# EAGLE design cert3d_rev2 (EAGLE 9.4.1)
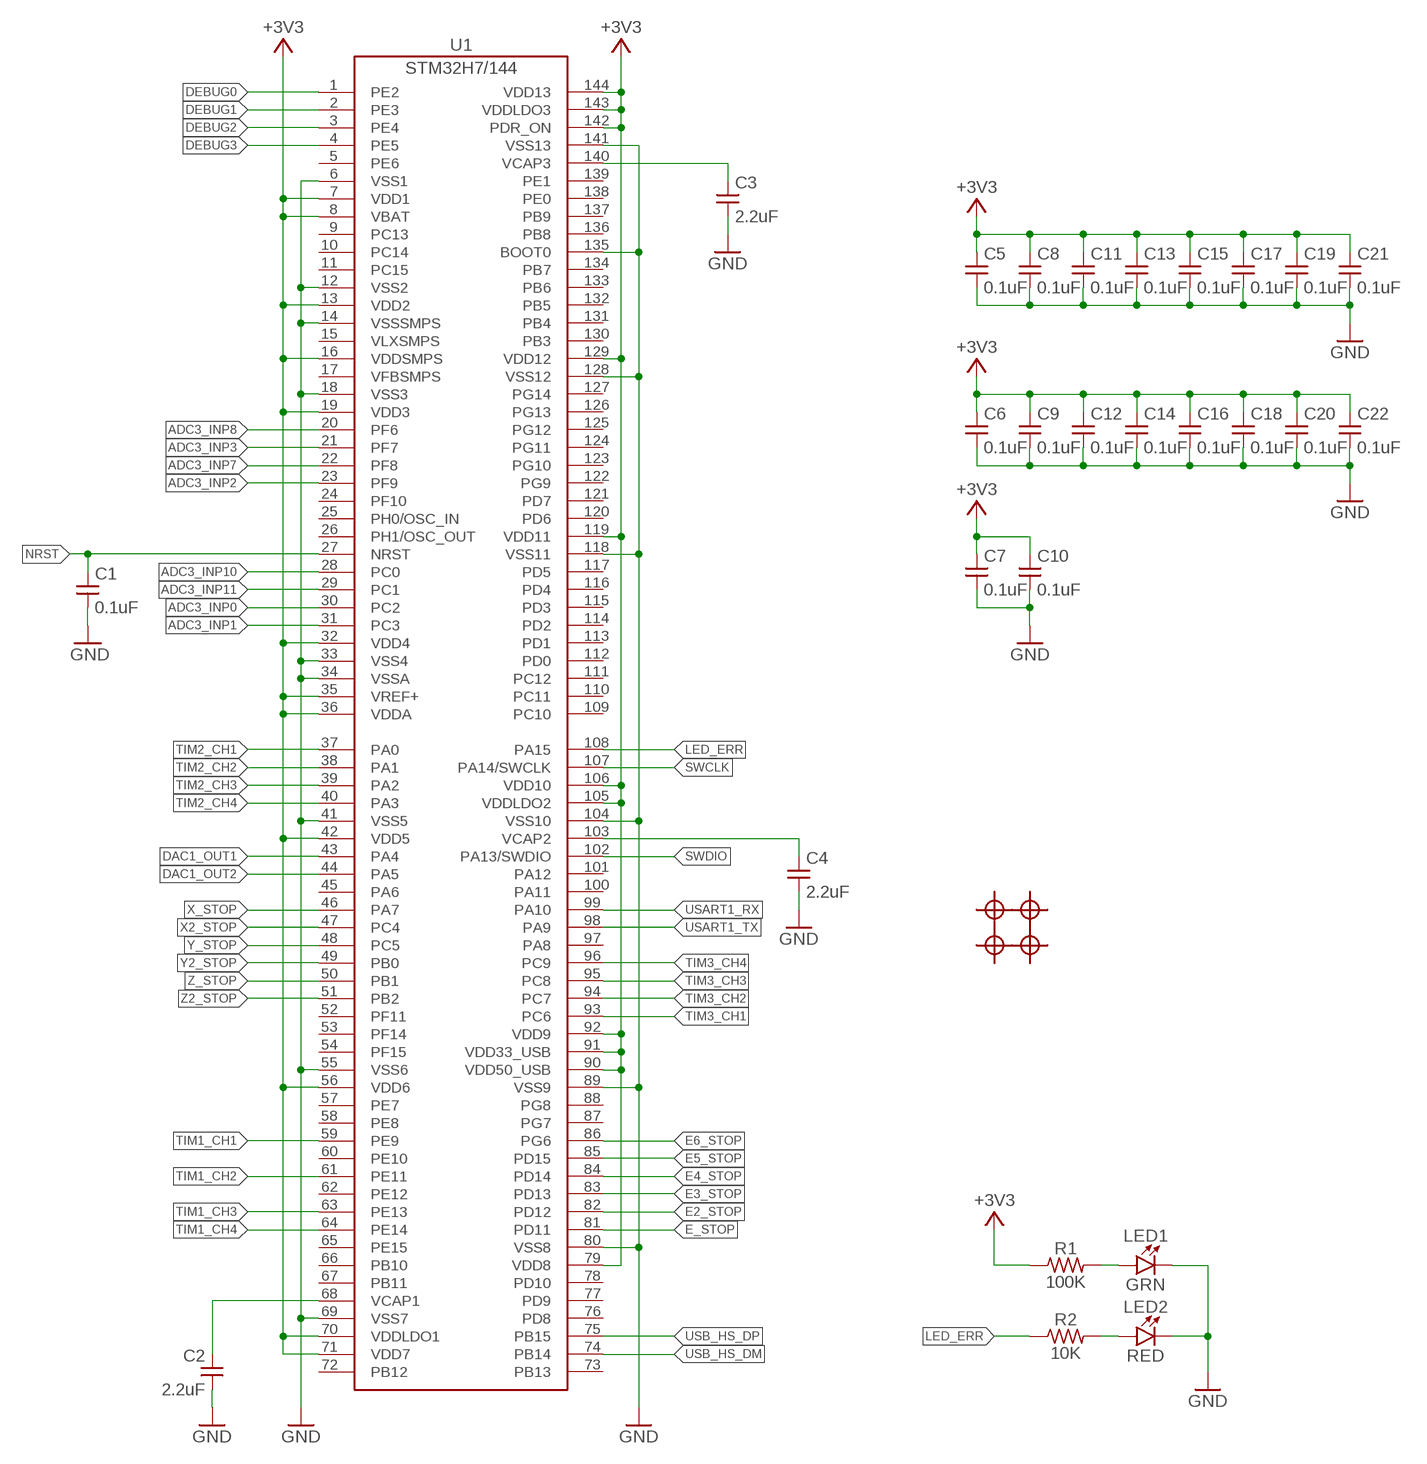
[diagram p0: schematic, sheet 1, part 1 of 2]
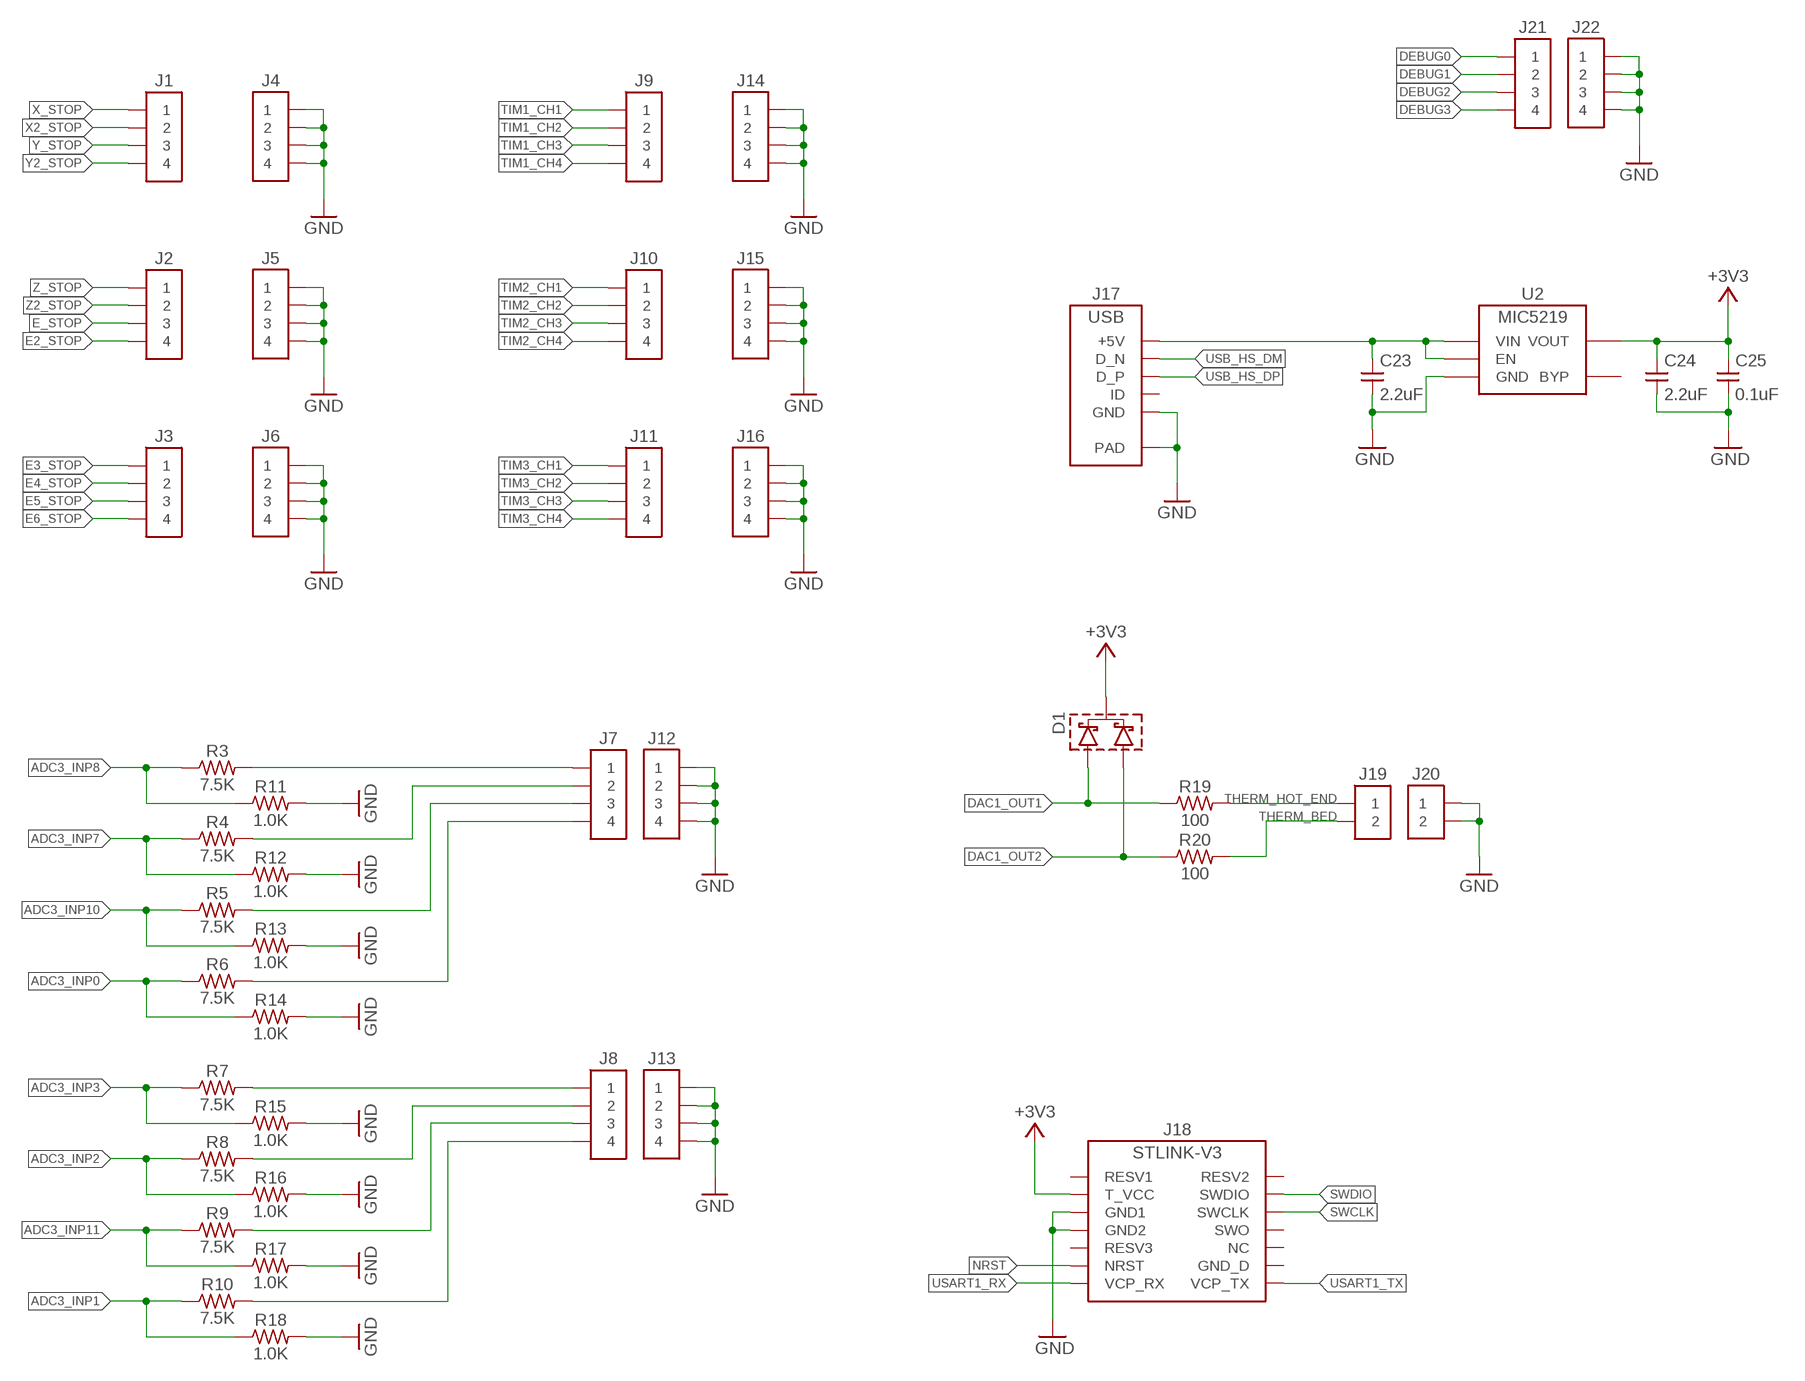
[diagram p1: schematic, sheet 1, part 2 of 2]

## Parts
C1  0.1uF  C_USC0805-5MIL  [C0805-5MIL]
C2  2.2uF  C_USC0805-5MIL  [C0805-5MIL]
C3  2.2uF  C_USC0805-5MIL  [C0805-5MIL]
C4  2.2uF  C_USC0805-5MIL  [C0805-5MIL]
C5  0.1uF  C_USC0805-5MIL  [C0805-5MIL]
C6  0.1uF  C_USC0805-5MIL  [C0805-5MIL]
C7  0.1uF  C_USC0805-5MIL  [C0805-5MIL]
C8  0.1uF  C_USC0805-5MIL  [C0805-5MIL]
C9  0.1uF  C_USC0805-5MIL  [C0805-5MIL]
C10  0.1uF  C_USC0805-5MIL  [C0805-5MIL]
C11  0.1uF  C_USC0805-5MIL  [C0805-5MIL]
C12  0.1uF  C_USC0805-5MIL  [C0805-5MIL]
C13  0.1uF  C_USC0805-5MIL  [C0805-5MIL]
C14  0.1uF  C_USC0805-5MIL  [C0805-5MIL]
C15  0.1uF  C_USC0805-5MIL  [C0805-5MIL]
C16  0.1uF  C_USC0805-5MIL  [C0805-5MIL]
C17  0.1uF  C_USC0805-5MIL  [C0805-5MIL]
C18  0.1uF  C_USC0805-5MIL  [C0805-5MIL]
C19  0.1uF  C_USC0805-5MIL  [C0805-5MIL]
C20  0.1uF  C_USC0805-5MIL  [C0805-5MIL]
C21  0.1uF  C_USC0805-5MIL  [C0805-5MIL]
C22  0.1uF  C_USC0805-5MIL  [C0805-5MIL]
C23  2.2uF  C_USC0805-5MIL  [C0805-5MIL]
C24  2.2uF  C_USC0805-5MIL  [C0805-5MIL]
C25  0.1uF  C_USC0805-5MIL  [C0805-5MIL]
D1  SCHOTTKY_DUAL_CCBAT54C  [SOT23-3]
FD1  FIDUCIAL  [FID1MM]
FD2  FIDUCIAL  [FID1MM]
FD3  FIDUCIAL  [FID1MM]
FD4  FIDUCIAL  [FID1MM]
J1  CONN4TSW-S  [SAM-TSW-104-XX-X-S]
J2  CONN4TSW-S  [SAM-TSW-104-XX-X-S]
J3  CONN4TSW-S  [SAM-TSW-104-XX-X-S]
J4  CONN4TSW-S  [SAM-TSW-104-XX-X-S]
J5  CONN4TSW-S  [SAM-TSW-104-XX-X-S]
J6  CONN4TSW-S  [SAM-TSW-104-XX-X-S]
J7  CONN4TSW-S  [SAM-TSW-104-XX-X-S]
J8  CONN4TSW-S  [SAM-TSW-104-XX-X-S]
J9  CONN4TSW-S  [SAM-TSW-104-XX-X-S]
J10  CONN4TSW-S  [SAM-TSW-104-XX-X-S]
J11  CONN4TSW-S  [SAM-TSW-104-XX-X-S]
J12  CONN4TSW-S  [SAM-TSW-104-XX-X-S]
J13  CONN4TSW-S  [SAM-TSW-104-XX-X-S]
J14  CONN4TSW-S  [SAM-TSW-104-XX-X-S]
J15  CONN4TSW-S  [SAM-TSW-104-XX-X-S]
J16  CONN4TSW-S  [SAM-TSW-104-XX-X-S]
J17  USB-5PINTOPVIA  [HIR-ZX62R-B-5P-VIAS]
J18  STLINK-V3/SWDCNC-3220  [CNC-3220-14-0100-00]
J19  CONN2TSW-S  [SAM-TSW-102-XX-X-S]
J20  CONN2TSW-S  [SAM-TSW-102-XX-X-S]
J21  CONN4TSW-S  [SAM-TSW-104-XX-X-S]
J22  CONN4TSW-S  [SAM-TSW-104-XX-X-S]
LED1  GRN  LEDCHIPLED0805-SMALL  [CHIPLED0805-SMALL]
LED2  RED  LEDCHIPLED0805-SMALL  [CHIPLED0805-SMALL]
R1  100K  R_USRES0805-5MIL  [RES0805R-5MIL]
R2  10K  R_USRES0805-5MIL  [RES0805R-5MIL]
R3  7.5K  R_USRES0805-5MIL  [RES0805R-5MIL]
R4  7.5K  R_USRES0805-5MIL  [RES0805R-5MIL]
R5  7.5K  R_USRES0805-5MIL  [RES0805R-5MIL]
R6  7.5K  R_USRES0805-5MIL  [RES0805R-5MIL]
R7  7.5K  R_USRES0805-5MIL  [RES0805R-5MIL]
R8  7.5K  R_USRES0805-5MIL  [RES0805R-5MIL]
R9  7.5K  R_USRES0805-5MIL  [RES0805R-5MIL]
R10  7.5K  R_USRES0805-5MIL  [RES0805R-5MIL]
R11  1.0K  R_USRES0805-5MIL  [RES0805R-5MIL]
R12  1.0K  R_USRES0805-5MIL  [RES0805R-5MIL]
R13  1.0K  R_USRES0805-5MIL  [RES0805R-5MIL]
R14  1.0K  R_USRES0805-5MIL  [RES0805R-5MIL]
R15  1.0K  R_USRES0805-5MIL  [RES0805R-5MIL]
R16  1.0K  R_USRES0805-5MIL  [RES0805R-5MIL]
R17  1.0K  R_USRES0805-5MIL  [RES0805R-5MIL]
R18  1.0K  R_USRES0805-5MIL  [RES0805R-5MIL]
R19  100  R_USRES0805-5MIL  [RES0805R-5MIL]
R20  100  R_USRES0805-5MIL  [RES0805R-5MIL]
U1  STM32H745-144  [LQFP144-20X20MM]
U2  MIC5219  [SOT23-5]

## Nets
+3V3: C5.1 C6.1 C7.1 C8.1 C9.1 C10.1 C11.1 C12.1 C13.1 C14.1 C15.1 C16.1 C17.1 C18.1 C19.1 C20.1 C21.1 C22.1 C24.1 C25.1 D1.3(C) J18.3(T_VCC) R1.1 U1.7(VDD1) U1.8(VBAT) U1.13(VDD2) U1.16(VDDSMPS) U1.19(VDD3) U1.32(VDD4) U1.35(VREF+) U1.36(VDDA) U1.42(VDD5) U1.56(VDD6) U1.70(VDDLDO1) U1.71(VDD7) U1.79(VDD8) U1.90(VDD50_USB) U1.91(VDD33_USB) U1.92(VDD9) U1.105(VDDLDO2) U1.106(VDD10) U1.119(VDD11) U1.129(VDD12) U1.142(PDR_ON) U1.143(VDDLDO3) U1.144(VDD13) U2.5(VOUT)
ADC3_INP0: R6.1 R14.1 U1.30(PC2)
ADC3_INP1: R10.1 R18.1 U1.31(PC3)
ADC3_INP2: R8.1 R16.1 U1.23(PF9)
ADC3_INP3: R7.1 R15.1 U1.21(PF7)
ADC3_INP7: R4.1 R12.1 U1.22(PF8)
ADC3_INP8: R3.1 R11.1 U1.20(PF6)
ADC3_INP10: R5.1 R13.1 U1.28(PC0)
ADC3_INP11: R9.1 R17.1 U1.29(PC1)
DAC1_OUT1: D1.1(A1) R19.1 U1.43(PA4)
DAC1_OUT2: D1.2(A2) R20.1 U1.44(PA5)
DEBUG0: J21.1 U1.1(PE2)
DEBUG1: J21.2 U1.2(PE3)
DEBUG2: J21.3 U1.3(PE4)
DEBUG3: J21.4 U1.4(PE5)
E2_STOP: J2.4 U1.82(PD12)
E3_STOP: J3.1 U1.83(PD13)
E4_STOP: J3.2 U1.84(PD14)
E5_STOP: J3.3 U1.85(PD15)
E6_STOP: J3.4 U1.86(PG6)
E_STOP: J2.3 U1.81(PD11)
GND: C1.2 C2.2 C3.2 C4.2 C5.2 C6.2 C7.2 C8.2 C9.2 C10.2 C11.2 C12.2 C13.2 C14.2 C15.2 C16.2 C17.2 C18.2 C19.2 C20.2 C21.2 C22.2 C23.2 C24.2 C25.2 J4.1 J4.2 J4.3 J4.4 J5.1 J5.2 J5.3 J5.4 J6.1 J6.2 J6.3 J6.4 J12.1 J12.2 J12.3 J12.4 J13.1 J13.2 J13.3 J13.4 J14.1 J14.2 J14.3 J14.4 J15.1 J15.2 J15.3 J15.4 J16.1 J16.2 J16.3 J16.4 J17.5(GND) J17.PAD@1(PAD) J17.PAD@2(PAD) J17.PAD@3(PAD) J17.PAD@4(PAD) J17.PAD@5(PAD) J17.PAD@6(PAD) J17.PAD@7(PAD) J17.PAD@8(PAD) J17.PAD@9(PAD) J17.PAD@10(PAD) J17.PAD@11(PAD) J17.PAD@12(PAD) J18.5(GND1) J18.7(GND2) J20.1 J20.2 J22.1 J22.2 J22.3 J22.4 LED1.C LED2.C R11.2 R12.2 R13.2 R14.2 R15.2 R16.2 R17.2 R18.2 U1.6(VSS1) U1.12(VSS2) U1.14(VSSSMPS) U1.18(VSS3) U1.33(VSS4) U1.34(VSSA) U1.41(VSS5) U1.55(VSS6) U1.69(VSS7) U1.80(VSS8) U1.89(VSS9) U1.104(VSS10) U1.118(VSS11) U1.128(VSS12) U1.135(BOOT0) U1.141(VSS13) U2.2(GND)
LED_ERR: R2.1 U1.108(PA15)
N$1: C2.1 U1.68(VCAP1)
N$2: C4.1 U1.103(VCAP2)
N$3: J7.3 R5.2
N$5: J7.1 R3.2
N$6: J8.2 R8.2
N$7: J7.2 R4.2
N$9: C3.1 U1.140(VCAP3)
N$10: C23.1 J17.1(+5V) U2.1(VIN) U2.3(EN)
N$13: J8.3 R9.2
N$14: J7.4 R6.2
N$15: J8.4 R10.2
N$16: J8.1 R7.2
N$23: LED2.A R2.2
N$24: LED1.A R1.2
NRST: C1.1 J18.11(NRST) U1.27(NRST)
SWCLK: J18.6(SWCLK) U1.107(PA14/SWCLK)
SWDIO: J18.4(SWDIO) U1.102(PA13/SWDIO)
THERM_BED: J19.2 R20.2
THERM_HOT_END: J19.1 R19.2
TIM1_CH1: J9.1 U1.59(PE9)
TIM1_CH2: J9.2 U1.61(PE11)
TIM1_CH3: J9.3 U1.63(PE13)
TIM1_CH4: J9.4 U1.64(PE14)
TIM2_CH1: J10.1 U1.37(PA0)
TIM2_CH2: J10.2 U1.38(PA1)
TIM2_CH3: J10.3 U1.39(PA2)
TIM2_CH4: J10.4 U1.40(PA3)
TIM3_CH1: J11.1 U1.93(PC6)
TIM3_CH2: J11.2 U1.94(PC7)
TIM3_CH3: J11.3 U1.95(PC8)
TIM3_CH4: J11.4 U1.96(PC9)
USART1_RX: J18.13(VCP_RX) U1.99(PA10)
USART1_TX: J18.14(VCP_TX) U1.98(PA9)
USB_HS_DM: J17.2(D_N) U1.74(PB14)
USB_HS_DP: J17.3(D_P) U1.75(PB15)
X2_STOP: J1.2 U1.47(PC4)
X_STOP: J1.1 U1.46(PA7)
Y2_STOP: J1.4 U1.49(PB0)
Y_STOP: J1.3 U1.48(PC5)
Z2_STOP: J2.2 U1.51(PB2)
Z_STOP: J2.1 U1.50(PB1)
Unconnected: J17.4(ID) J18.1(RESV1) J18.2(RESV2) J18.8(SWO) J18.9(RESV3) J18.10(NC) J18.12(GND_D) U1.5(PE6) U1.9(PC13) U1.10(PC14) U1.11(PC15) U1.15(VLXSMPS) U1.17(VFBSMPS) U1.24(PF10) U1.25(PH0/OSC_IN) U1.26(PH1/OSC_OUT) U1.45(PA6) U1.52(PF11) U1.53(PF14) U1.54(PF15) U1.57(PE7) U1.58(PE8) U1.60(PE10) U1.62(PE12) U1.65(PE15) U1.66(PB10) U1.67(PB11) U1.72(PB12) U1.73(PB13) U1.76(PD8) U1.77(PD9) U1.78(PD10) U1.87(PG7) U1.88(PG8) U1.97(PA8) U1.100(PA11) U1.101(PA12) U1.109(PC10) U1.110(PC11) U1.111(PC12) U1.112(PD0) U1.113(PD1) U1.114(PD2) U1.115(PD3) U1.116(PD4) U1.117(PD5) U1.120(PD6) U1.121(PD7) U1.122(PG9) U1.123(PG10) U1.124(PG11) U1.125(PG12) U1.126(PG13) U1.127(PG14) U1.130(PB3) U1.131(PB4) U1.132(PB5) U1.133(PB6) U1.134(PB7) U1.136(PB8) U1.137(PB9) U1.138(PE0) U1.139(PE1) U2.4(BYP)

## Library data of the parts
C1 C5-C22 C25 = kcl_passives:C_US; PN: C0805C104K5RACTU
C2-C4 = kcl_passives:C_US; PN: C0805C225K3RAC7800
C23 C24 = kcl_passives:C_US; PN: C0805C225K8RACTU
D1 = kcl_passives:SCHOTTKY_DUAL_CC; PN: BAT54CLT1G
FD1-FD4 = kcl_extra:FIDUCIAL; PN: DNI
J1-J16 J21 J22 = kcl_connectors_auto:CONN4; PN: TSW-104-07-F-S
J17 = kcl_connectors:USB-5PIN; PN: ZX62R-B-5P(30)
J18 = kcl_connectors:STLINK-V3/SWD; PN: 3220-14-0100-00
J19 J20 = kcl_connectors_auto:CONN2; PN: TSW-102-07-F-S
LED1 = kcl_passives:LED; PN: 150080GS75000
LED2 = kcl_passives:LED; PN: 150080RS75000
R1 = kcl_passives:R_US; PN: CRCW0805100KFKEA
R2 = kcl_passives:R_US; PN: CRCW080510K0FKEA
R3-R10 = kcl_passives:R_US; PN: CRCW08057K50FKEA
R11-R18 = kcl_passives:R_US; PN: CRCW08051K00FKEA
R19 R20 = kcl_passives:R_US; PN: CRCW0805100RFKEA
U1 = kcl_ics:STM32H745-144
U2 = kcl_ics:MIC5219; PN: MIC5323-3.3YD5-TR

## Net classes
0 default: width 0.254 mm

## Board
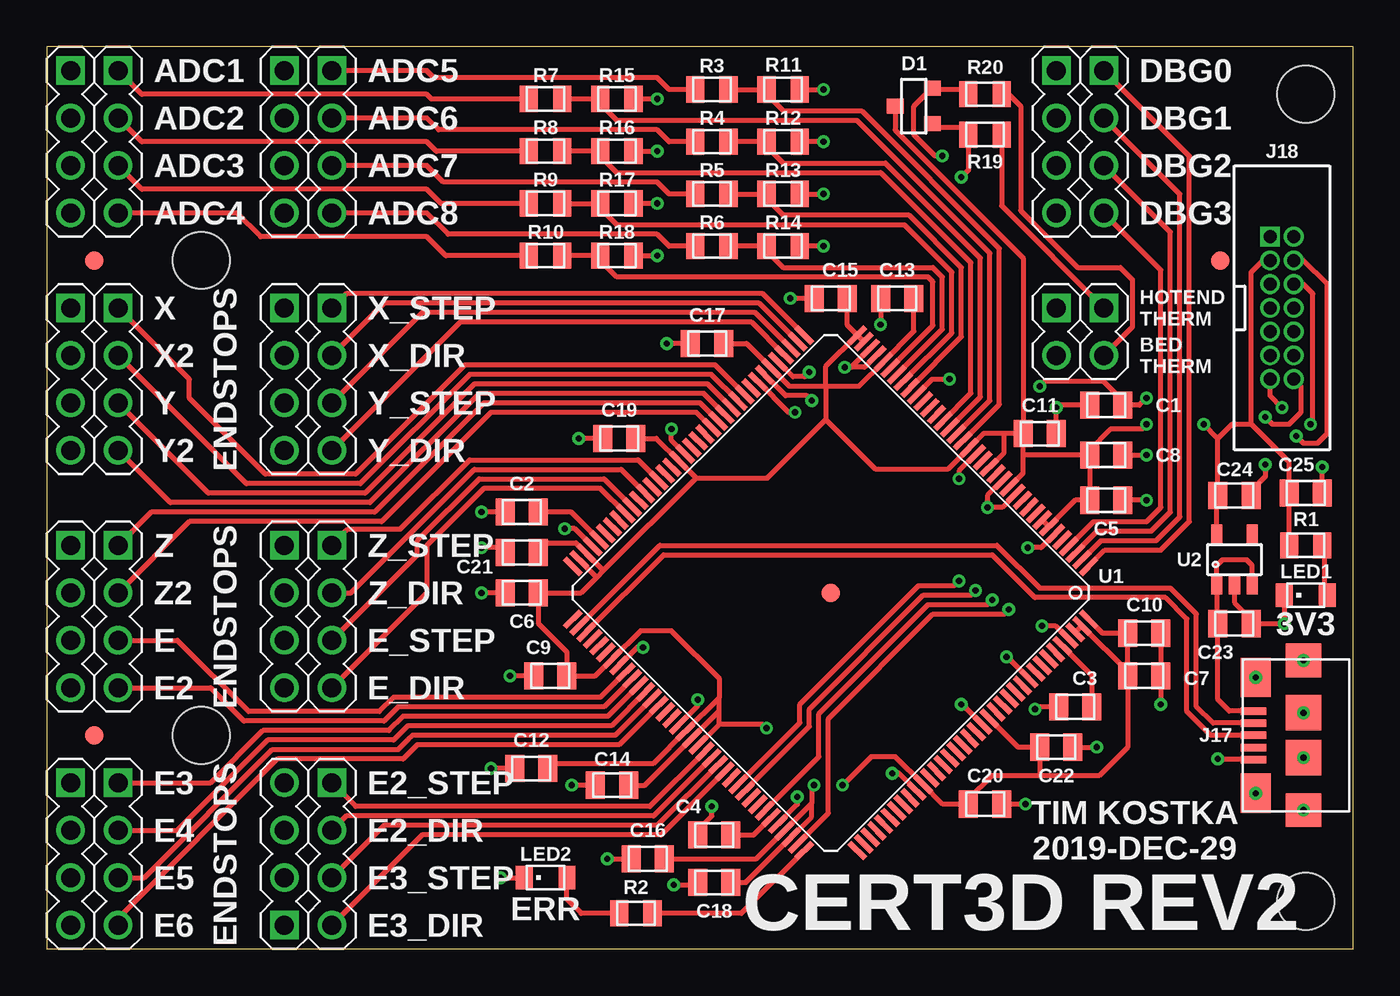
[diagram p2: board, top side]
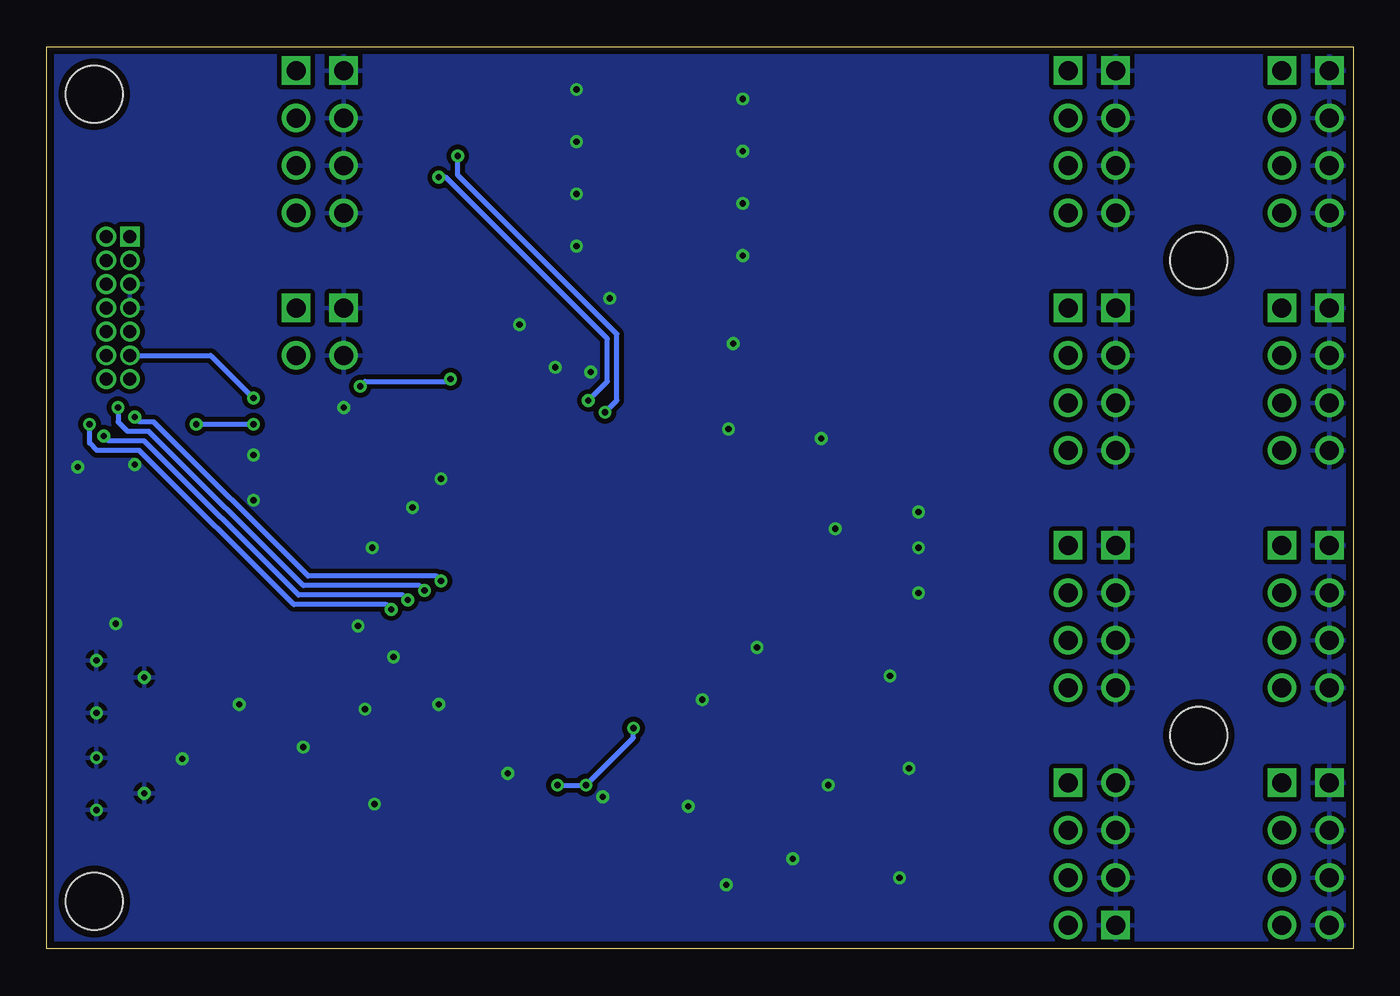
[diagram p3: board, bottom side, seen from below]

Size 69.85 x 48.26 mm. Coordinates in mm from the lower left corner, seen from the top.
Outline: 0,0 69.85,0 69.85,48.26 0,48.26 0,0
Copper layers (1*16): Top 0.0356mm / dielectric 1.5011mm / Bottom 0.0356mm
Design rules "oshpark-2layer *": minimum track width 6mil, minimum drill 13mil, track to track 6mil, track to pad 6mil, pad to pad 6mil, via to via 6mil, smd to smd 6mil, copper to edge 15mil, drill to drill 6mil, minimum pad ring 7mil, minimum via ring 7mil, stop-mask expansion 4mil, vias tented up to drill 13mil, thermal gap 10mil
Holes 3.05 mm at 8.26,36.83 8.26,11.43 67.31,2.54 67.31,45.72

### Footprints (pad centres in the part's own frame; a part is rotated, then mirrored left to right if it is on the bottom)
C0805-5MIL = smd 1.016 x 1.448: 1 -0.889,0; 2 0.889,0
SOT23-3 = smd 0.9 x 0.8: 1 -1,0.95; 2 -1,-0.95; 3 1,0
FID1MM = smd 1 x 1: 1 0,0
SAM-TSW-104-XX-X-S = drill 1.016 square: 1 -3.81,0 | drill 1.016: 2 -1.27,0; 3 1.27,0; 4 3.81,0
HIR-ZX62R-B-5P-VIAS = smd 0.4 x 1.35: 1 -1.3,0; 2 -0.65,0; 3 0,0; 4 0.65,0; 5 1.3,0 | smd 2.1 x 1.6: PAD@1 3.1,0.125; PAD@2 -3.1,0.125 | smd 1.8 x 1.9: PAD@3 4,2.675; PAD@4 -4,2.675 | smd 1.9 x 1.9: PAD@5 1.2,2.675; PAD@6 -1.2,2.675 | drill 0.33: PAD@7 -3.1,0.125; PAD@8 -4,2.675; PAD@9 -1.2,2.675; PAD@10 1.2,2.675; PAD@11 4,2.675; PAD@12 3.1,0.125
CNC-3220-14-0100-00 = drill 0.7 square: 1 -0.635,3.81 | drill 0.7: 2 0.635,3.81; 3 -0.635,2.54; 4 0.635,2.54; 5 -0.635,1.27; 6 0.635,1.27; 7 -0.635,0; 8 0.635,0; 9 -0.635,-1.27; 10 0.635,-1.27; 11 -0.635,-2.54; 12 0.635,-2.54; 13 -0.635,-3.81; 14 0.635,-3.81
SAM-TSW-102-XX-X-S = drill 1.016 square: 1 -1.27,0 | drill 1.016: 2 1.27,0
CHIPLED0805-SMALL = smd 0.9 x 1.25: A 1.143,0; C -1.143,0
RES0805R-5MIL = smd 0.965 x 1.4: 1 -0.889,0; 2 0.889,0
LQFP144-20X20MM = smd 1.2 x 0.3: 1 -10.75,8.75; 2 -10.75,8.25; 3 -10.75,7.75; 4 -10.75,7.25; 5 -10.75,6.75; 6 -10.75,6.25; 7 -10.75,5.75; 8 -10.75,5.25; 9 -10.75,4.75; 10 -10.75,4.25; 11 -10.75,3.75; 12 -10.75,3.25; 13 -10.75,2.75; 14 -10.75,2.25; 15 -10.75,1.75; 16 -10.75,1.25; 17 -10.75,0.75; 18 -10.75,0.25; 19 -10.75,-0.25; 20 -10.75,-0.75; 21 -10.75,-1.25; 22 -10.75,-1.75; 23 -10.75,-2.25; 24 -10.75,-2.75; 25 -10.75,-3.25; 26 -10.75,-3.75; 27 -10.75,-4.25; 28 -10.75,-4.75; 29 -10.75,-5.25; 30 -10.75,-5.75; 31 -10.75,-6.25; 32 -10.75,-6.75; 33 -10.75,-7.25; 34 -10.75,-7.75; 35 -10.75,-8.25; 36 -10.75,-8.75; 73 10.75,-8.75; 74 10.75,-8.25; 75 10.75,-7.75; 76 10.75,-7.25; 77 10.75,-6.75; 78 10.75,-6.25; 79 10.75,-5.75; 80 10.75,-5.25; 81 10.75,-4.75; 82 10.75,-4.25; 83 10.75,-3.75; 84 10.75,-3.25; 85 10.75,-2.75; 86 10.75,-2.25; 87 10.75,-1.75; 88 10.75,-1.25; 89 10.75,-0.75; 90 10.75,-0.25; 91 10.75,0.25; 92 10.75,0.75; 93 10.75,1.25; 94 10.75,1.75; 95 10.75,2.25; 96 10.75,2.75; 97 10.75,3.25; 98 10.75,3.75; 99 10.75,4.25; 100 10.75,4.75; 101 10.75,5.25; 102 10.75,5.75; 103 10.75,6.25; 104 10.75,6.75; 105 10.75,7.25; 106 10.75,7.75; 107 10.75,8.25; 108 10.75,8.75 | smd 0.3 x 1.2: 37 -8.75,-10.75; 38 -8.25,-10.75; 39 -7.75,-10.75; 40 -7.25,-10.75; 41 -6.75,-10.75; 42 -6.25,-10.75; 43 -5.75,-10.75; 44 -5.25,-10.75; 45 -4.75,-10.75; 46 -4.25,-10.75; 47 -3.75,-10.75; 48 -3.25,-10.75; 49 -2.75,-10.75; 50 -2.25,-10.75; 51 -1.75,-10.75; 52 -1.25,-10.75; 53 -0.75,-10.75; 54 -0.25,-10.75; 55 0.25,-10.75; 56 0.75,-10.75; 57 1.25,-10.75; 58 1.75,-10.75; 59 2.25,-10.75; 60 2.75,-10.75; 61 3.25,-10.75; 62 3.75,-10.75; 63 4.25,-10.75; 64 4.75,-10.75; 65 5.25,-10.75; 66 5.75,-10.75; 67 6.25,-10.75; 68 6.75,-10.75; 69 7.25,-10.75; 70 7.75,-10.75; 71 8.25,-10.75; 72 8.75,-10.75; 109 8.75,10.75; 110 8.25,10.75; 111 7.75,10.75; 112 7.25,10.75; 113 6.75,10.75; 114 6.25,10.75; 115 5.75,10.75; 116 5.25,10.75; 117 4.75,10.75; 118 4.25,10.75; 119 3.75,10.75; 120 3.25,10.75; 121 2.75,10.75; 122 2.25,10.75; 123 1.75,10.75; 124 1.25,10.75; 125 0.75,10.75; 126 0.25,10.75; 127 -0.25,10.75; 128 -0.75,10.75; 129 -1.25,10.75; 130 -1.75,10.75; 131 -2.25,10.75; 132 -2.75,10.75; 133 -3.25,10.75; 134 -3.75,10.75; 135 -4.25,10.75; 136 -4.75,10.75; 137 -5.25,10.75; 138 -5.75,10.75; 139 -6.25,10.75; 140 -6.75,10.75; 141 -7.25,10.75; 142 -7.75,10.75; 143 -8.25,10.75; 144 -8.75,10.75
SOT23-5 = smd 1.05 x 0.6: 1 -1.35,0.95; 2 -1.35,0; 3 -1.35,-0.95; 4 1.35,-0.95; 5 1.35,0.95

### Placement (x,y rotation side)
C1  56.64,29.08 180 top
C2  25.4,23.37 180 top
C3  54.99,12.95 180 top
C4  35.69,6.1 180 top
C5  56.64,24 0 top
C6  25.4,19.05 180 top
C7  58.67,14.61 0 top
C8  56.64,26.42 0 top
C9  26.92,14.61 180 top
C10  58.67,16.89 0 top
C11  53.09,27.56 0 top
C12  25.91,9.65 180 top
C13  45.47,34.8 180 top
C14  30.23,8.76 180 top
C15  41.91,34.8 180 top
C16  32.13,4.83 180 top
C17  35.31,32.38 180 top
C18  35.69,3.56 180 top
C19  30.61,27.3 180 top
C20  50.16,7.75 0 top
C21  25.4,21.21 180 top
C22  53.98,10.79 0 top
C23  63.5,17.4 0 top
C24  63.5,24.26 0 top
C25  67.31,24.38 0 top
D1  46.35,45.09 180 top
FD1  2.54,36.83 0 top
FD2  41.91,19.05 0 top
FD3  62.74,36.83 0 top
FD4  2.54,11.43 0 top
J1  3.81,30.48 270 top
J2  3.81,17.78 270 top
J3  3.81,5.08 270 top
J4  1.27,30.48 270 top
J5  1.27,17.78 270 top
J6  1.27,5.08 270 top
J7  15.24,43.18 270 top
J8  3.81,43.18 270 top
J9  15.24,17.78 270 top
J10  15.24,30.48 270 top
J11  15.24,5.08 270 top
J12  1.27,43.18 270 top
J13  12.7,43.18 270 top
J14  12.7,17.78 270 top
J15  12.7,30.48 270 top
J16  12.7,5.08 90 top
J17  64.52,11.43 270 top
J18  66.04,34.29 0 top
J19  56.52,33.02 270 top
J20  53.98,33.02 270 top
J21  56.52,43.18 270 top
J22  53.98,43.18 270 top
LED1  67.31,18.92 0 top
LED2  26.67,3.81 0 top
R1  67.31,21.59 0 top
R2  31.5,1.91 180 top
R3  35.56,45.97 180 top
R4  35.56,43.18 180 top
R5  35.56,40.39 180 top
R6  35.56,37.59 180 top
R7  26.67,45.47 180 top
R8  26.67,42.67 180 top
R9  26.67,39.88 180 top
R10  26.67,37.08 180 top
R11  39.37,45.97 0 top
R12  39.37,43.18 0 top
R13  39.37,40.39 0 top
R14  39.37,37.59 0 top
R15  30.48,45.47 0 top
R16  30.48,42.67 0 top
R17  30.48,39.88 0 top
R18  30.48,37.08 0 top
R19  50.16,43.56 0 top
R20  50.16,45.72 0 top
U1  41.91,19.05 225 top
U2  63.5,20.83 90 top

### Tracks (layer width: path | path; a pad name or v marks a point on that pad's centre or on a via)
+3V3  (via drill 0.33)
  Top 0.254: C11.1 51.18,27.56 | 51.18,27.56 50.06,27.56 U1.19 48.16,25.65 44.32,25.65 41.66,28.32 | U1.35 U1.36 | C17.1 37.41,32.38 U1.42 39.7,30.1 41.66,30.1 | C19.1 32.59,27.3 U1.56 34.71,25.19 | C14.1 31.98,8.76 U1.91 35.94,12.73 | C16.1 37.94,4.83 U1.105 40.89,7.78 | C18.1 37.38,3.56 U1.106 40.89,7.07 40.89,7.78 | U1.129 51.93,10.79 C22.1 53.09,9.27 | U1.144 56.44,16.89 C10.1 C7.1 | C7.1 57.78,14.84 U1.143 U1.142 | U1.36 42.8,33.36 C15.1 | C13.1 46.35,33.04 U1.32 43.41,30.1 41.66,30.1 | C21.1 26.8,21.72 28.28,21.72 U1.70 29.76,20.24 | 29.76,20.24 29.41,19.88 | 29.41,19.88 28.57,19.05 C6.1 26.29,17.4 27.81,15.88 C9.1 29.33,14.61 U1.79 31.75,17.02 33.4,17.02 35.94,14.48 35.94,13.44 | C12.1 27.05,9.91 32.41,9.91 U1.90 35.94,13.44 | U1.16 51.18,26.55 51.18,27.56 | R1.1 C25.1 66.42,26.04 64.39,28.07 | U1.71 29.41,19.88 | 29.76,20.24 34.71,25.19 | 35.94,12.73 35.94,13.44 | U1.92 35.94,12.02 | 35.94,12.02 35.94,12.73 | U2.5 62.55,24.2 C24.1 62.61,27.3 | C7.1 57.78,10.79 56.26,9.27 53.09,9.27 | 53.09,9.27 50.55,9.27 49.28,8 C20.1 47.91,7.75 U1.119 45.37,10.29 44.07,10.29 v42.55,8.76 | U1.36 41.66,31.17 41.66,30.1 | 41.66,30.1 41.66,28.32 | 41.66,28.32 38.52,25.19 34.71,25.19 | U1.8 U1.7 54.99,24 C5.1 C8.1 | J18.3 65.02,36.83 64.39,36.2 64.39,28.07 | 62.61,27.3 v61.85,28.07 | 62.61,27.3 63.37,28.07 64.39,28.07 | v58.8,28.07 58.55,27.81 56.9,27.81 55.75,26.67 C8.1 | 40.89,7.78 40.89,8.64 v41.02,8.76 | v38.48,11.81 38.27,12.02 35.94,12.02 | U1.13 52.2,25.45 52.2,26.42 | 52.2,26.42 C11.1 | C8.1 52.2,26.42 | D1.3 45.35,43.8 52.2,36.96 C11.1
  Bottom 0.254: v61.85,28.07 v58.8,28.07 | v42.55,8.76 v41.02,8.76 38.48,11.3 v38.48,11.81
ADC3_INP0
  Top 0.254: U1.30 47.88,33.15 47.88,35.94 47.37,36.45 39.37,36.45 38.48,37.34 R14.1 R6.1
ADC3_INP1
  Top 0.254: U1.31 47.37,33.35 47.37,35.69 47.12,35.94 30.48,35.94 29.59,36.83 R18.1 R10.1
ADC3_INP2
  Top 0.254: U1.23 49.4,29.73 49.4,36.7 44.58,41.53 30.48,41.53 29.59,42.42 R16.1 R8.1
ADC3_INP3
  Top 0.254: U1.21 50.42,29.33 50.42,37.21 43.31,44.32 30.48,44.32 29.59,45.21 R15.1 R7.1
ADC3_INP7
  Top 0.254: U1.22 49.91,29.53 49.91,36.96 44.83,42.04 39.37,42.04 38.48,42.93 R12.1 R4.1
ADC3_INP8
  Top 0.254: U1.20 50.93,29.13 50.93,37.47 43.56,44.83 39.37,44.83 38.48,45.72 R11.1 R3.1
ADC3_INP10
  Top 0.254: U1.28 48.9,32.75 48.9,36.45 46.1,39.24 39.37,39.24 38.48,40.13 R13.1 R5.1
ADC3_INP11
  Top 0.254: U1.29 48.39,32.95 48.39,36.2 45.85,38.73 30.48,38.73 29.59,39.62 R17.1 R9.1
DAC1_OUT1  (via drill 0.33)
  Top 0.254: D1.1 47.55,43.94 48.9,43.94 R19.1 49.28,41.66 v48.9,41.27 | U1.43 39.5,29.59 40.64,29.59 v40.89,29.34
  Bottom 0.254: v40.89,29.34 39.88,30.35 39.88,32.64 48.51,41.27 v48.9,41.27
DAC1_OUT2  (via drill 0.33)
  Top 0.254: R20.1 49.02,45.97 47.42,45.97 D1.2 47.3,46.03 46.35,45.09 46.35,43.56 47.5,42.42 v47.88,42.42 | U1.44 39.68,28.7 v40.01,28.7
  Bottom 0.254: v40.01,28.7 39.37,29.34 39.37,32.89 47.88,41.4 v47.88,42.42
DEBUG0
  Top 0.254: U1.1 56.57,21.34 59.56,21.34 61.09,22.86 61.09,42.42 J21.1
DEBUG1
  Top 0.254: U1.2 56.37,21.84 59.31,21.84 60.58,23.11 60.58,40.39 J21.2
DEBUG2
  Top 0.254: U1.3 56.17,22.35 59.05,22.35 60.07,23.37 60.07,38.35 J21.3
DEBUG3
  Top 0.254: U1.4 55.97,22.86 58.8,22.86 59.56,23.62 59.56,36.32 J21.4
E2_STOP
  Top 0.254: J2.4 8.76,13.97 10.54,12.19 18.03,12.19 18.8,12.95 29.8,12.95 U1.82
E3_STOP
  Top 0.254: J3.1 8.76,8.89 11.56,11.68 18.29,11.68 19.05,12.45 30,12.45 U1.83
E4_STOP
  Top 0.254: J3.2 6.99,6.35 11.81,11.18 18.54,11.18 19.3,11.94 30.2,11.94 U1.84
E5_STOP
  Top 0.254: J3.3 5.21,3.81 12.06,10.67 18.8,10.67 19.3,11.18 19.56,11.43 30.4,11.43 U1.85
E6_STOP
  Top 0.254: J3.4 3.81,1.65 12.32,10.16 19.05,10.16 19.81,10.92 30.6,10.92 U1.86
E_STOP
  Top 0.254: J2.3 6.99,16.51 10.79,12.7 17.78,12.7 18.54,13.46 29.6,13.46 U1.81
GND  (via drill 0.33)
  Top 0.254: v41.53,37.59 R14.2 | R13.2 v41.53,40.39 | v41.53,43.18 R12.2 | R11.2 v41.53,45.97 | v32.64,45.47 R15.2 | R16.2 v32.64,42.67 | v32.64,39.88 R17.2 | R18.2 v32.64,37.08 | C2.2 v23.24,23.37 | C21.2 24.26,21.46 v23.24,21.46 | C6.2 v23.24,19.05 | C19.2 v28.45,27.3 | C17.2 v33.15,32.38 | C9.2 v24.77,14.61 | C12.2 v23.75,9.65 | U1.69 28.23,22.48 v27.69,22.48 | U1.55 33.4,27.2 v33.4,27.81 | C15.2 v39.75,34.8 | U1.41 39.9,30.61 40.51,30.61 v40.77,30.86 | U1.33 43.72,31.11 43.02,31.11 | 43.02,31.11 v42.67,31.11 | U1.34 43.02,31.11 | C8.2 v58.8,26.42 | v58.8,24 C5.2 | C13.2 v44.58,33.4 | C14.2 v28.07,8.76 | v29.97,4.83 C16.2 | v33.53,3.43 34.67,3.43 C18.2 | v24.26,3.81 LED2.C | U1.80 31.56,16.13 v31.88,16.13 | U1.89 34.8,13 v34.8,13.34 | U1.141 53.94,17.27 v53.21,17.27 | U1.135 51.35,15.62 v51.31,15.62 | U1.128 48.94,13.08 v48.9,13.08 | U1.118 45.55,9.4 v45.21,9.4 | U1.104 40.13,7.73 v40.13,8.13 | C4.2 34.8,6.35 35.56,7.11 v35.56,7.62 | J17.5 62.64,10.13 v62.61,10.16 | LED1.C v66.16,17.41 v66.17,17.4 C23.2 64.39,17.65 63.5,18.54 U2.2 | C25.2 v68.2,25.78 | C24.2 64.39,24.51 65.15,25.27 v65.15,25.91 | C10.2 C7.2 v59.56,13.08 | C22.2 v56.13,10.79 | C3.2 52.96,12.95 v52.83,12.83 | v52.32,7.75 C20.2 | C11.2 v53.98,28.96 54.1,29.08 C1.2 | U1.6 53.16,21.46 v52.45,21.46 | U1.12 51.08,23.62 v50.29,23.62 50.29,24.25 U1.14 | U1.18 48.77,25.55 v48.77,25.15
  pour Bottom (isolate 0.254, rank 2): -2.54,50.8 72.39,50.8 72.39,-2.54 -2.54,-2.54
LED_ERR
  Top 0.254: U1.108 37.14,1.91 R2.1
N$1
  Top 0.254: U1.68 28.05,23.37 C2.1
N$2
  Top 0.254: C4.1 37.8,6.1 U1.103
N$3
  Top 0.254: R5.2 33.27,40.39 32.64,41.02 21.21,41.02 20.32,41.91 J7.3
N$5
  Top 0.254: R3.2 33.27,45.97 32.64,46.61 20.7,46.61 20.32,46.99 J7.1
N$6
  Top 0.254: J8.2 5.08,43.18 20.32,43.18 20.83,42.67 R8.2
N$7
  Top 0.254: R4.2 33.27,43.18 32.64,43.81 20.95,43.81 20.32,44.45 J7.2
N$9
  Top 0.254: U1.140 55.88,14.63 C3.1
N$10
  Top 0.254: J17.1 63.22,12.73 62.61,13.34 C23.1 | U2.3 64.45,20.51 64.14,20.83 62.87,20.83 62.55,20.51 U2.1 62.55,17.46
  Top 0.406: 62.55,17.46 C23.1
N$13
  Top 0.254: J8.3 5.08,40.64 20.32,40.64 21.08,39.88 R9.2
N$14
  Top 0.254: R6.2 33.27,37.59 32.64,38.23 21.46,38.23 20.32,39.37 J7.4
N$15
  Top 0.254: J8.4 10.16,39.37 11.43,38.1 20.32,38.1 21.34,37.08 R10.2
N$16
  Top 0.254: J8.1 5.08,45.72 20.32,45.72 20.57,45.47 R7.2
N$23
  Top 0.254: R2.2 28.57,1.91 27.81,2.67 LED2.A
N$24
  Top 0.254: R1.2 68.33,21.46 68.33,19.06 LED1.A
NRST  (via drill 0.33)
  Top 0.254: v58.8,29.46 58.42,29.08 57.78,29.08 | 57.78,29.08 57.72,29.15 | 57.72,29.15 56.52,30.35 53.34,30.35 v53.09,30.1 | U1.27 47.33,30.48 v48.26,30.48 | 57.72,29.15 57.59,29.15 C1.1 57.78,29.08
  Bottom 0.254: J18.11 61.09,31.75 v58.8,29.46 | v53.09,30.1 52.83,30.35 48.39,30.35 v48.26,30.48
SWCLK  (via drill 0.33)
  Top 0.254: U1.107 41.78,7.26 41.78,12.32 47.37,17.91 51.18,17.91 v51.44,18.16 | v67.56,28.07 67.69,28.19 67.69,35.05 67.18,35.56 J18.6
  Bottom 0.254: v51.44,18.16 51.69,18.41 56.64,18.41 64.9,26.67 67.18,26.67 67.56,27.05 v67.56,28.07
SWDIO  (via drill 0.33)
  Top 0.254: U1.102 41.27,10.28 41.27,12.57 47.12,18.41 50.29,18.41 v50.55,18.67 | v66.8,27.43 67.18,27.05 67.94,27.05 68.45,27.56 68.45,35.56 67.18,36.83 J18.4
  Bottom 0.254: v50.55,18.67 50.8,18.92 56.39,18.92 64.64,27.18 66.55,27.18 v66.8,27.43
THERM_BED
  Top 0.254: R20.2 51.44,45.72 52.07,45.09 52.07,39.5 55.12,36.45 57.4,36.45 58.04,35.81 58.04,33.27 J19.2
THERM_HOT_END
  Top 0.254: R19.2 51.05,39.75 J19.1
TIM1_CH1
  Top 0.254: U1.59 31.62,26.16 22.61,26.16 18.9,22.45 16.1,22.45 J9.1
TIM1_CH2
  Top 0.254: U1.61 30.71,25.65 22.86,25.65 16.26,19.05 J9.2
TIM1_CH3
  Top 0.254: U1.63 29.8,25.15 23.11,25.15 19.81,21.84 19.81,21.08 J9.3
TIM1_CH4
  Top 0.254: U1.64 29.6,24.64 23.37,24.64 20.32,21.59 20.32,19.05 J9.4
TIM2_CH1
  Top 0.254: U1.37 38.28,35.05 16,35.05 J10.1
TIM2_CH2
  Top 0.254: U1.38 38.08,34.54 18.03,34.54 J10.2
TIM2_CH3
  Top 0.254: U1.39 37.88,34.04 20.07,34.04 J10.3
TIM2_CH4
  Top 0.254: U1.40 37.69,33.53 22.1,33.53 J10.4
TIM3_CH1
  Top 0.254: U1.93 32.25,7.62 16.51,7.62 J11.1
TIM3_CH2
  Top 0.254: U1.94 32.45,7.11 16,7.11 J11.2
TIM3_CH3
  Top 0.254: U1.95 32.65,6.6 18.03,6.6 J11.3
TIM3_CH4
  Top 0.254: U1.96 32.84,6.1 20.07,6.1 J11.4
USART1_RX  (via drill 0.33)
  Top 0.254: U1.99 40.77,11.9 40.77,12.83 46.86,18.92 49.4,18.92 v49.66,19.18 | J18.13 65.41,29.59 v66.04,28.96
  Bottom 0.254: v49.66,19.18 49.91,19.43 56.13,19.43 64.39,27.69 65.53,27.69 66.04,28.19 v66.04,28.96
USART1_TX  (via drill 0.33)
  Top 0.254: U1.98 40.26,12.1 40.26,13.08 46.61,19.43 48.51,19.43 v48.77,19.68 | v65.15,28.45 65.53,28.07 66.42,28.07 67.06,28.7 67.06,30.1 J18.14
  Bottom 0.254: v48.77,19.68 49.02,19.94 55.88,19.94 64.14,28.19 64.9,28.19 v65.15,28.45
USB_HS_DM
  Top 0.254: U1.74 32.78,21.59 50.8,21.59 53.09,19.3 60.07,19.3 61.47,17.91 61.47,12.95 62.34,12.08 J17.2
USB_HS_DP
  Top 0.254: U1.75 32.98,21.08 50.55,21.08 52.83,18.8 59.82,18.8 60.96,17.65 60.96,12.7 62.23,11.43 J17.3
X2_STOP
  Top 0.254: U1.47 35.53,30.73 22.61,30.73 16.76,24.89 10.67,24.89 J1.2
X_STOP
  Top 0.254: U1.46 35.73,31.24 22.35,31.24 16.51,25.4 11.68,25.4 7.62,29.46 7.62,30.48 J1.1
Y2_STOP
  Top 0.254: U1.49 35.13,29.72 23.11,29.72 17.27,23.88 6.6,23.88 J1.4
Y_STOP
  Top 0.254: U1.48 35.33,30.23 22.86,30.23 17.02,24.38 8.64,24.38 J1.3
Z2_STOP
  Top 0.254: U1.51 34.73,28.7 23.75,28.7 17.91,22.86 7.62,22.86 J2.2
Z_STOP
  Top 0.254: U1.50 34.93,29.21 23.37,29.21 17.53,23.37 5.59,23.37 J2.1

### Text on the board
tPlace: ADC1 | ADC5 | DBG0 | ADC2 | ADC6 | DBG1 | ADC3 | ADC7 | DBG2 | ADC4 | ADC8 | DBG3 | X | X_STEP | HOTEND / THERM | X2 | X_DIR | BED / THERM | ENDSTOPS | Y | Y_STEP | Y2 | Y_DIR | Z | Z_STEP | Z2 | Z_DIR | ENDSTOPS | 3V3 | E | E_STEP | E2 | E_DIR | E3 | E2_STEP | E4 | E2_DIR | TIM KOSTKA / 2019-DEC-29 | ENDSTOPS | E5 | E3_STEP | ERR | CERT3D REV2 | E6 | E3_DIR